# Altium schematic sheet BUTTONS.SchDoc
size A3; SheetNumber: 6; SheetTotal: 8
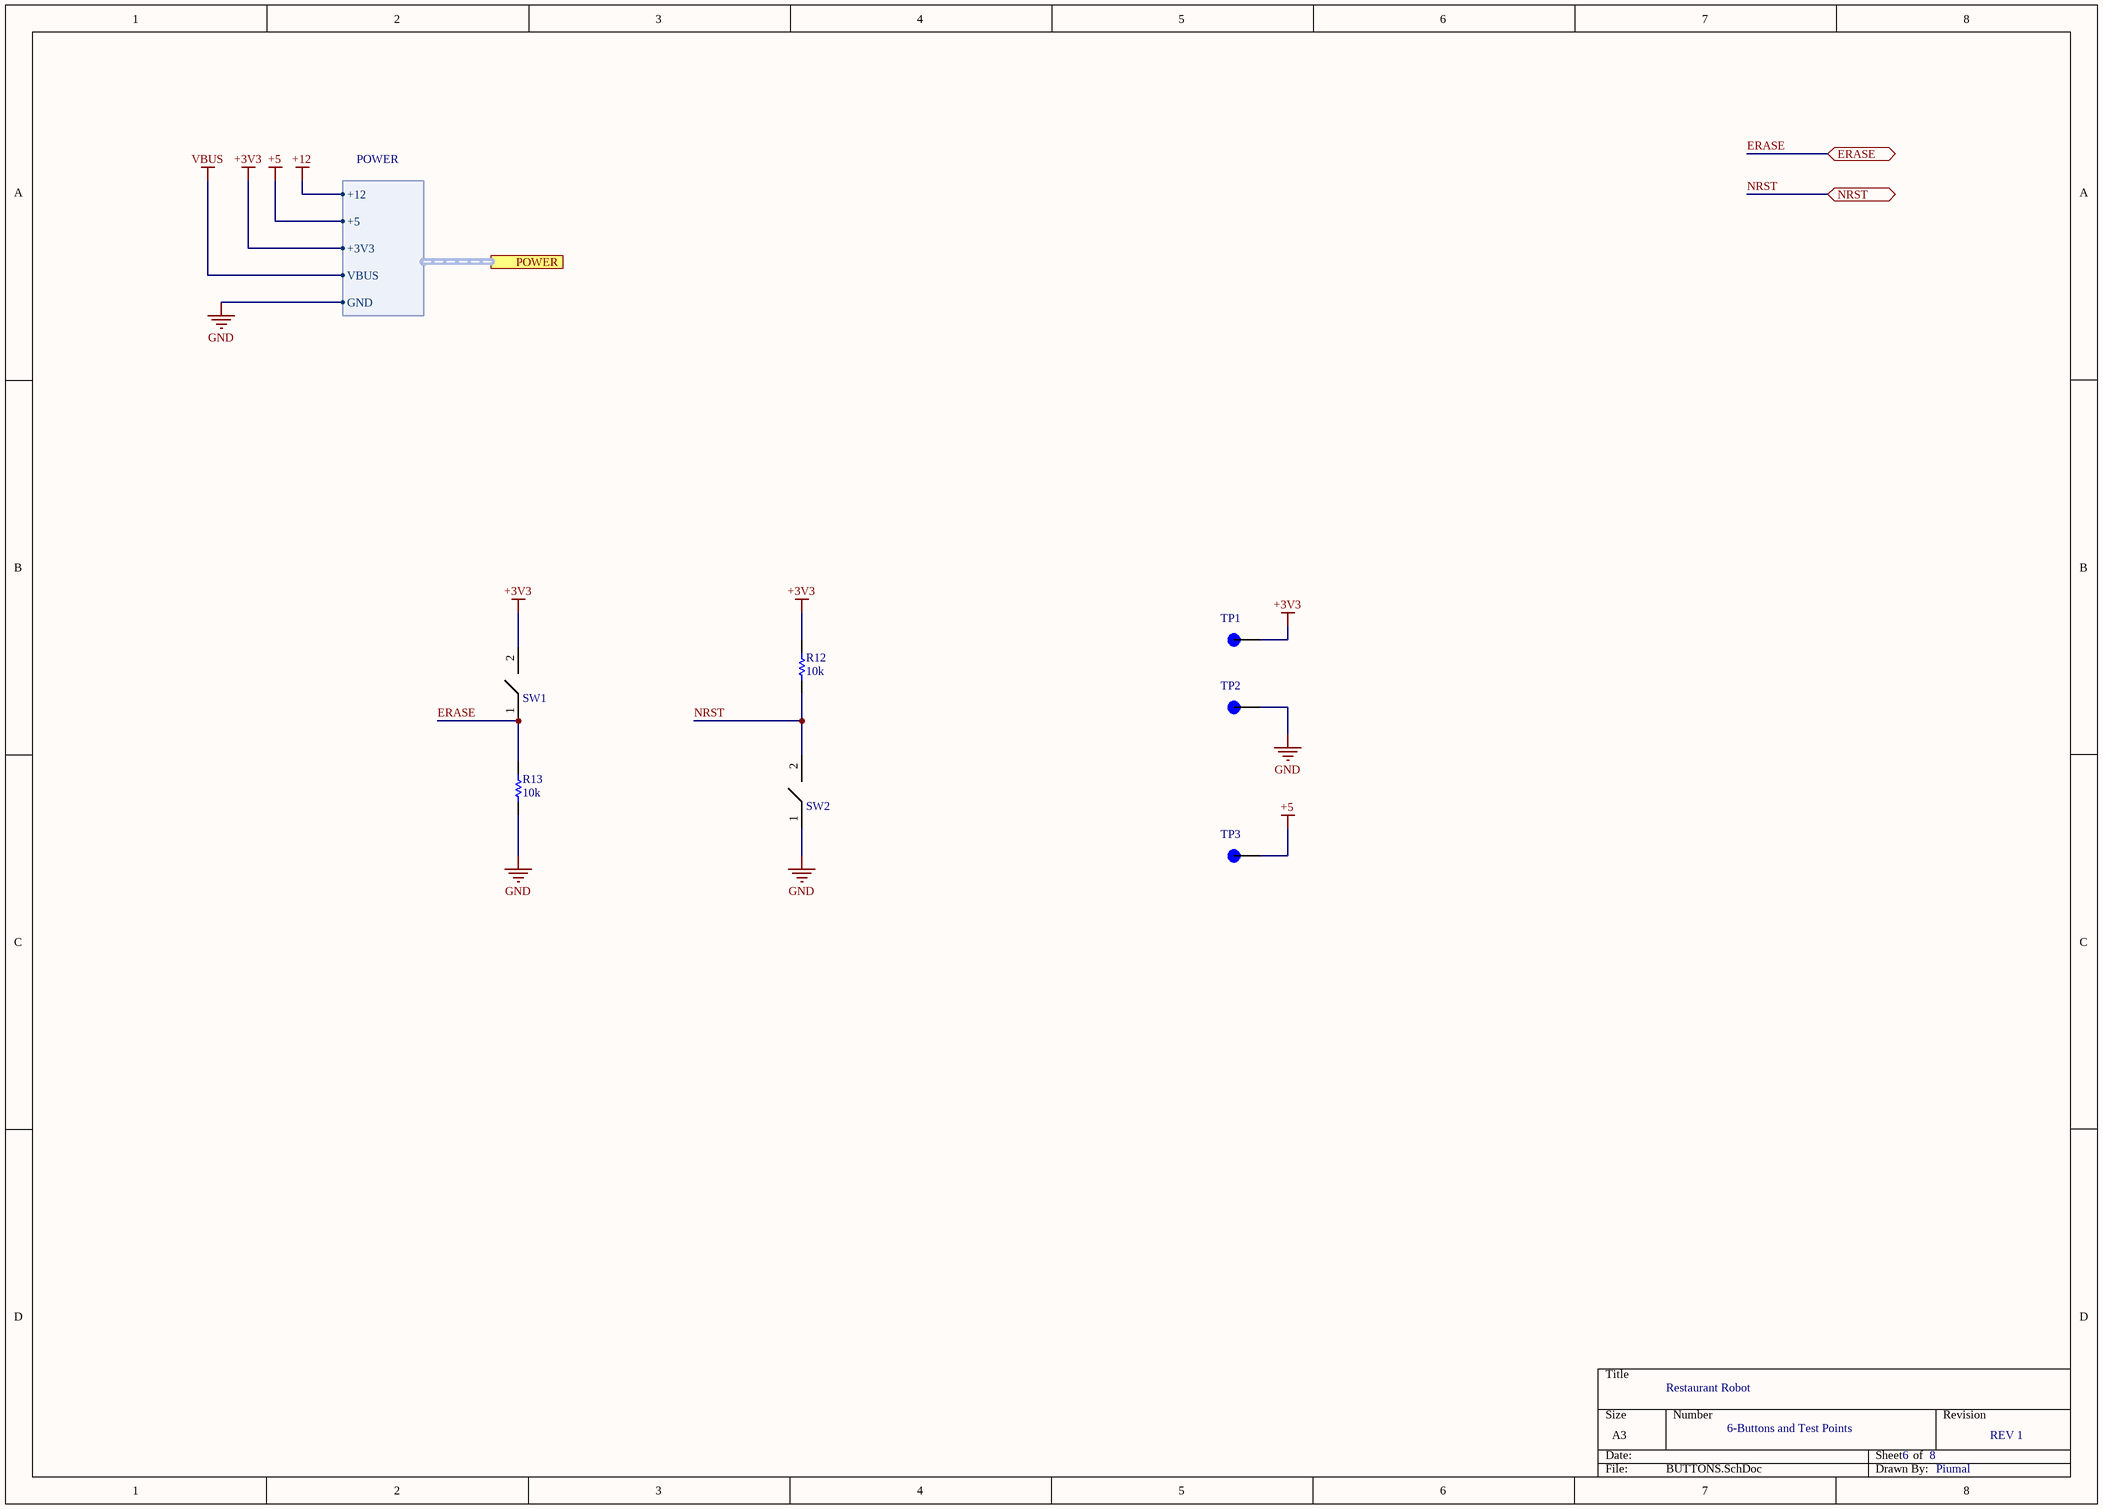
[diagram p0: BUTTONS.SchDoc]

## Parts
R12  Resistance: 10k  [RESC2013X60X35ML10T20]  (hidden comment: RC0805JR-0710KL)
R13  Resistance: 10k  [RESC2013X60X35ML10T20]  (hidden comment: RC0805JR-0710KL)
SW1  SWITCH  [PCBComponent_1]  (value not drawn)
SW2  SWITCH  [PCBComponent_1]  (value not drawn)
TP1  5000  [KEYSTONE_5000]  (value not drawn)
TP2  5000  [KEYSTONE_5000]  (value not drawn)
TP3  5000  [KEYSTONE_5000]  (value not drawn)

## Ports
ERASE (bidir), NRST (bidir), POWER (harness POWER)

## Harnesses
POWER: +3V3, GND, +5, VBUS, +12

## Nets
+3V3: R12.2 SW1.2 TP1.TP ; port POWER.+3V3
+5: TP3.TP ; port POWER.+5
+12: port POWER.+12
GND: R13.1 SW2.1 TP2.TP ; port POWER.GND
VBUS: port POWER.VBUS
ERASE: R13.2 SW1.1 ; port ERASE
NRST: R12.1 SW2.2 ; port NRST

## Notes on the sheet
- Restaurant Robot
- 6-Buttons and Test Points
- 6
- 8
- REV 1
- Piumal

## Library data of the parts
R12 R13 = CMP-2000-05025-1: Chip Resistor, 10 KOhm, +/- 5%, 0.125 W, -55 to 155 degC, 0805 (2012 Metric), RoHS, Tape and Reel; Manufacturer: Yageo; Resistor Element Type: ThickFilm; Voltage Rating: 150V; Product Range: RCSeries; SVHC: ToBeAdvised; Resistor Case Style: 0805[2012Metric]; Temperature Coefficient: ±100ppm/degC; Power Rating: 250mW; Automotive Qualification Standard: -; Datasheet Version: REV. 2, 09/2004; Packaging: CutTape; Resistance Tolerance: ±5%; MSL: MSL1-Unlimited; Manufacturer URL: http://www.yageo.com/; Datasheet URL: http://www.yageo.ru/pdf/RC0805.pdf; Package Description: 2-Pin Surface Mounted Device, Body 2 x 1.25 mm; Package Reference: 805
SW1 SW2 = SW: SWITCH TACTILE SPST-NO 0.05A 12V
TP1-TP3 = 5000: Test Point Miniature THM H .300 Nylon 46 Insulated Red PhosBronze/Silver | Keystone Electronics 5000; SnapEDA_Link: https://www.snapeda.com/parts/5000/Keystone/view-part/?ref=snap; Package: Test Point Keystone Electronics; Value: *; MF: Keystone Electronics; MP: 5000; Check_prices: https://www.snapeda.com/parts/5000/Keystone/view-part/?ref=eda